# EAGLE design Upper Board (EAGLE 5.12)
PARTNO: 43045-0406
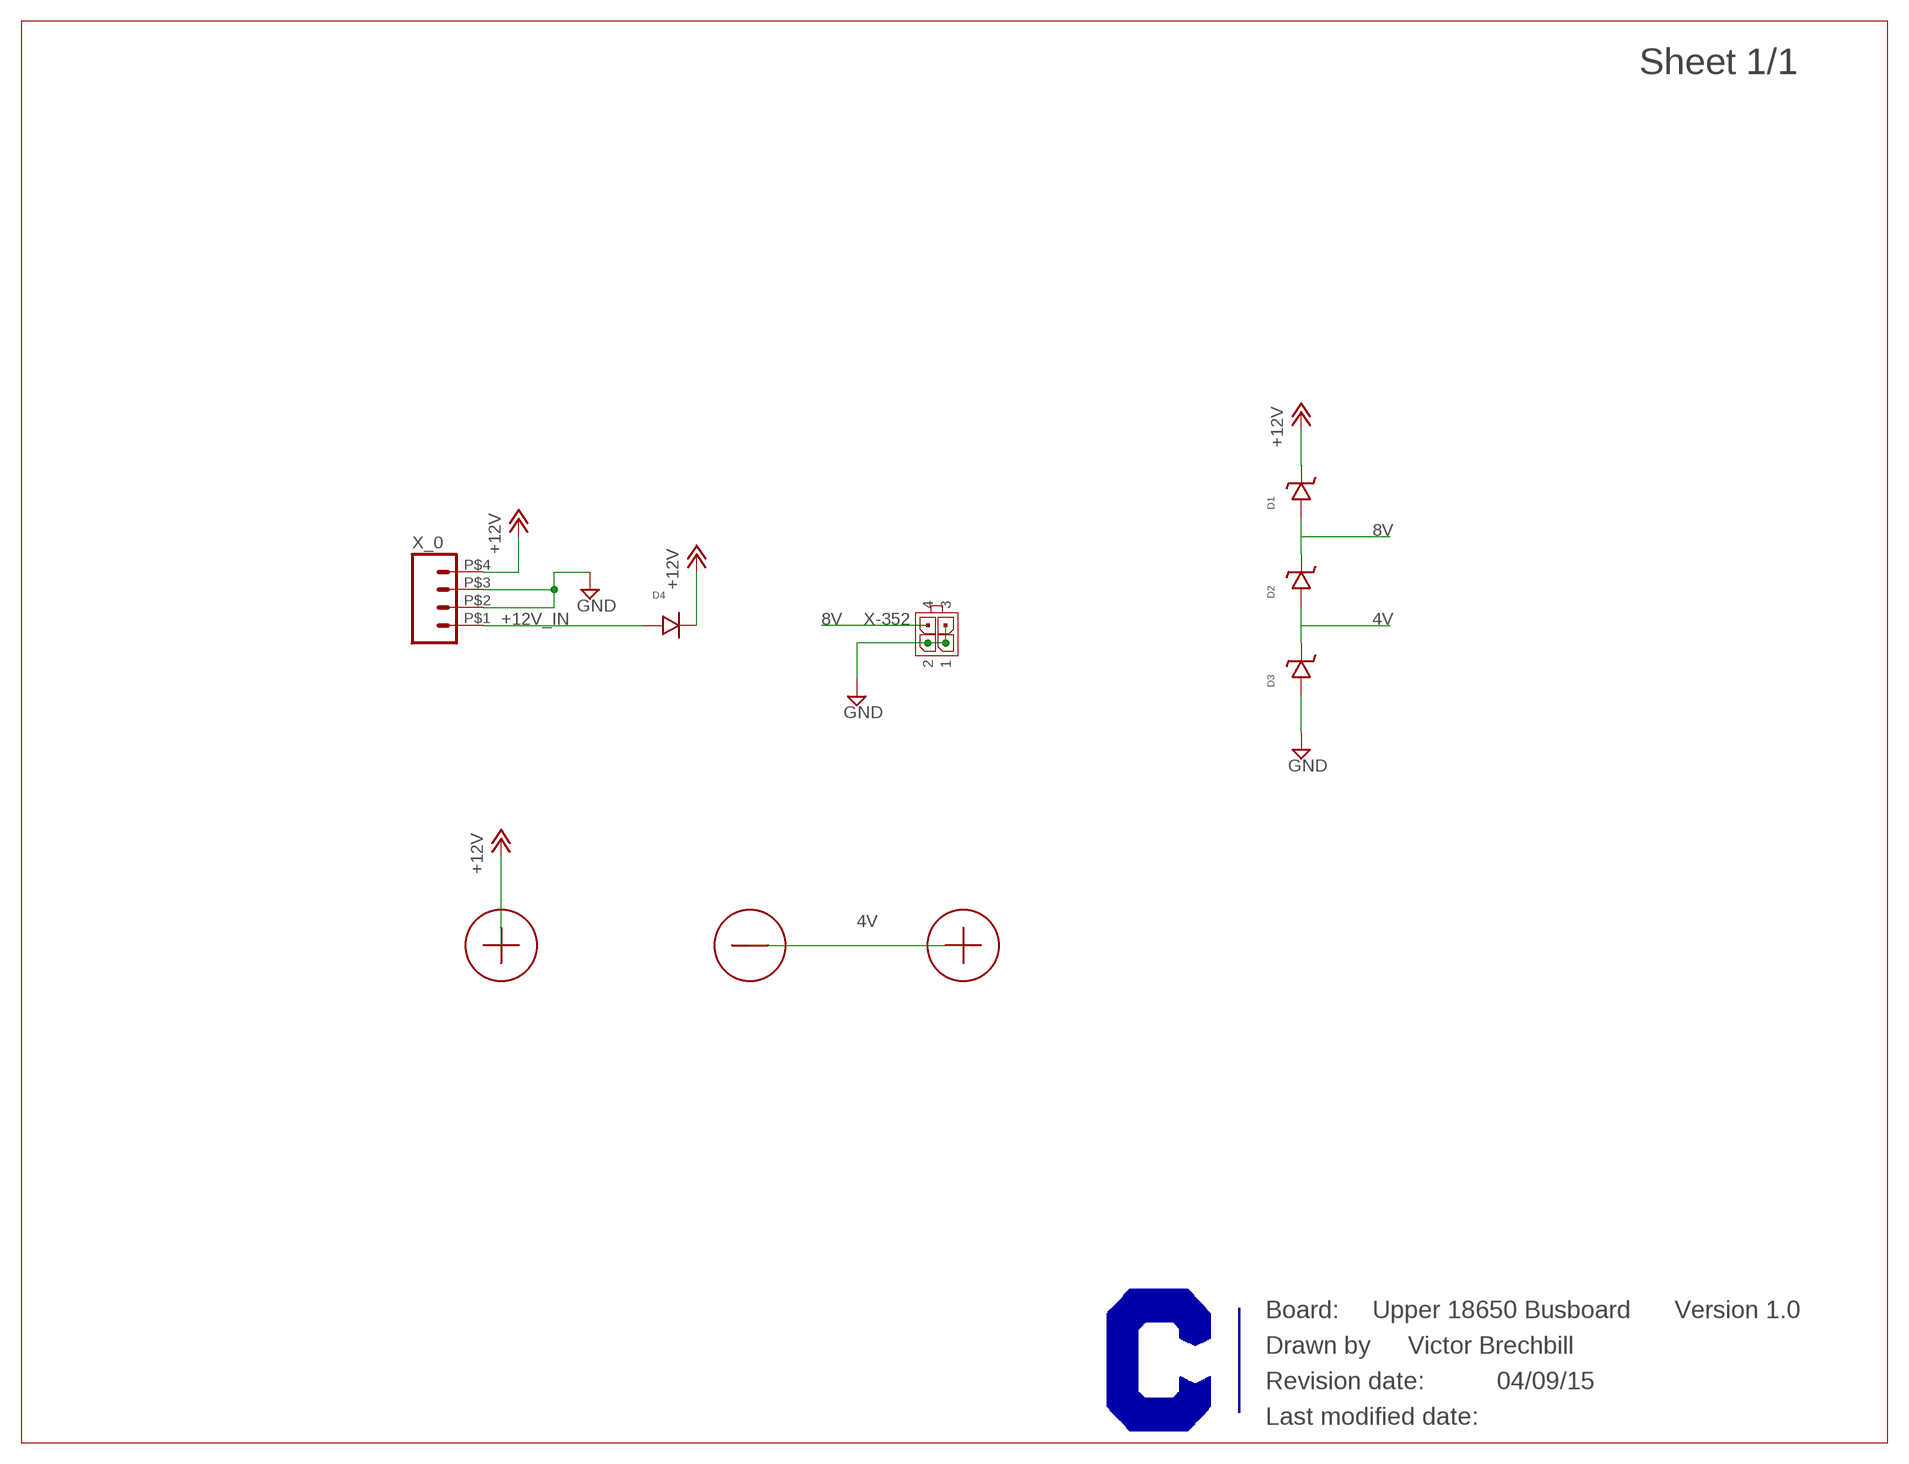
[diagram p0: schematic, sheet 1]

## Parts
D1  ZENER_DIODE-SOD-123  [SOD-123]
D2  ZENER_DIODE-SOD-123  [SOD-123]
D3  ZENER_DIODE-SOD-123  [SOD-123]
D4  RECT_DIODE  [DO-214AB]
U$1  CURRENT-C-LETTER-LANDSCAPE  [BLANK]
U$2  18650_PLUS  [BATTERY_CONTACT]
U$3  18650_PLUS  [BATTERY_CONTACT]
U$4  18650_MINUS  [BATTERY_CONTACT]
X-352  MICROFIT-04-DUAL-RA-SMD-CLIP_RETENTION  [MICROFIT-4-DUAL-RA-SMD-CLIP_RETENTION]
X_0  5MM_HEADER-4  [4POS-5MM]

## Nets
4V: D2.ANODE D3.CATHODE U$3.P$1 U$4.P$1
8V: D1.ANODE D2.CATHODE X-352.4
+12V: D1.CATHODE D4.C(CATHODE) U$2.P$1 X_0.P$4
+12V_IN: D4.A(ANODE) X_0.P$1
GND: D3.ANODE X-352.1 X-352.2 X-352.3 X_0.P$2 X_0.P$3

## Notes on the sheet
- Upper 18650 Busboard | Version 1.0
- Victor Brechbill
- 04/09/15

## Library data of the parts
D1-D3 = Diodes:ZENER_DIODE
D4 = Diodes:RECT_DIODE: Package DO-214AB http://www.digikey.com/product-detail/en/SK154-TP/SK154-TPCT-ND/1306217
U$1 = Frames:CURRENT-C-LETTER-LANDSCAPE; BOM: EXCLUDE
U$2 U$3 = Buckeye Current:18650_PLUS: http://www.digikey.com/product-detail/en/5223/5223K-ND/316374
U$4 = Buckeye Current:18650_MINUS: http://www.digikey.com/product-detail/en/5201/5201K-ND/316365
X-352 = Molex:MICROFIT-04-DUAL: Molex MicroFit 3.00mm Pitch Header, Surface Mount, Dual Row, 4 Circuits Molex P/N: 43045-0609 (vert) Drawing: http://www.molex.com/pdm_docs/sd/430450418_sd.pdf (vert) Information: http://www.molex.com/molex/products/datasheet.jsp?part=active/0430450418_PCB_HEADERS.xml (vert)
X_0 = Phoenix Contact:5MM_HEADER-4: 4 position, 5mm screw terminal header Pheonix Contact P/N: 1935187 Digikey 277-1579-ND <http://www.digikey.com/product-detail/en/1935187/277-1579-ND/568616>

## Board
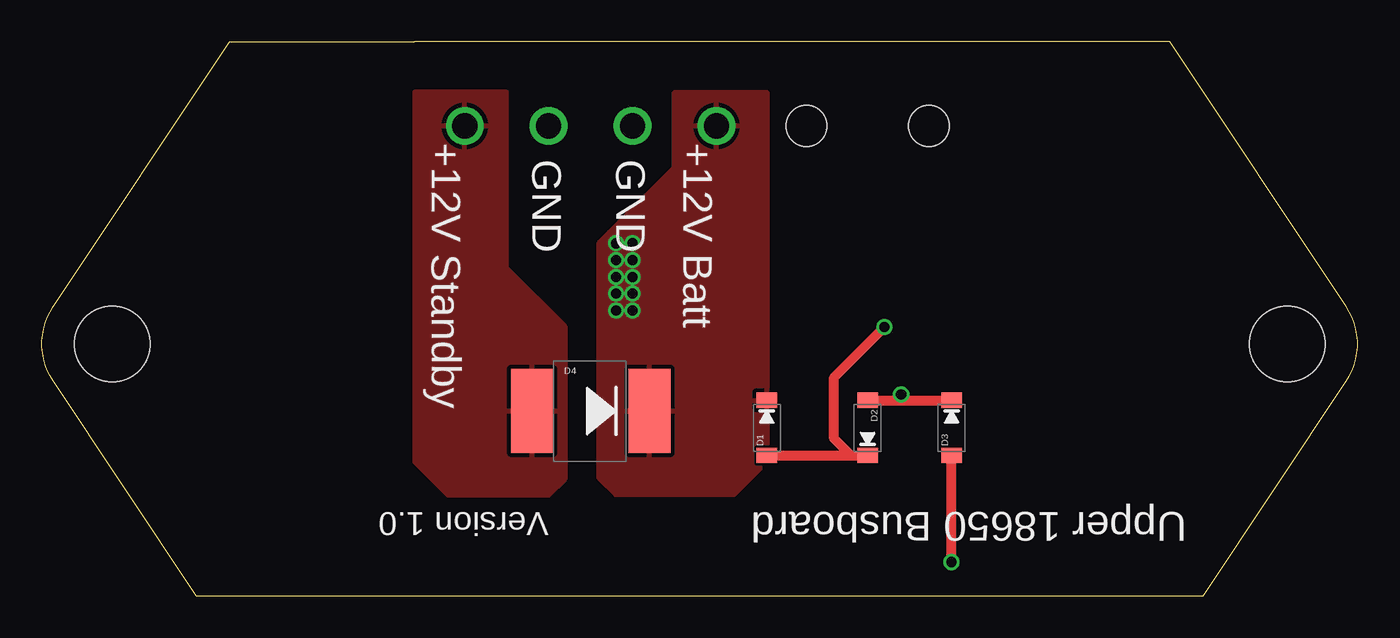
[diagram p1: board, top side]
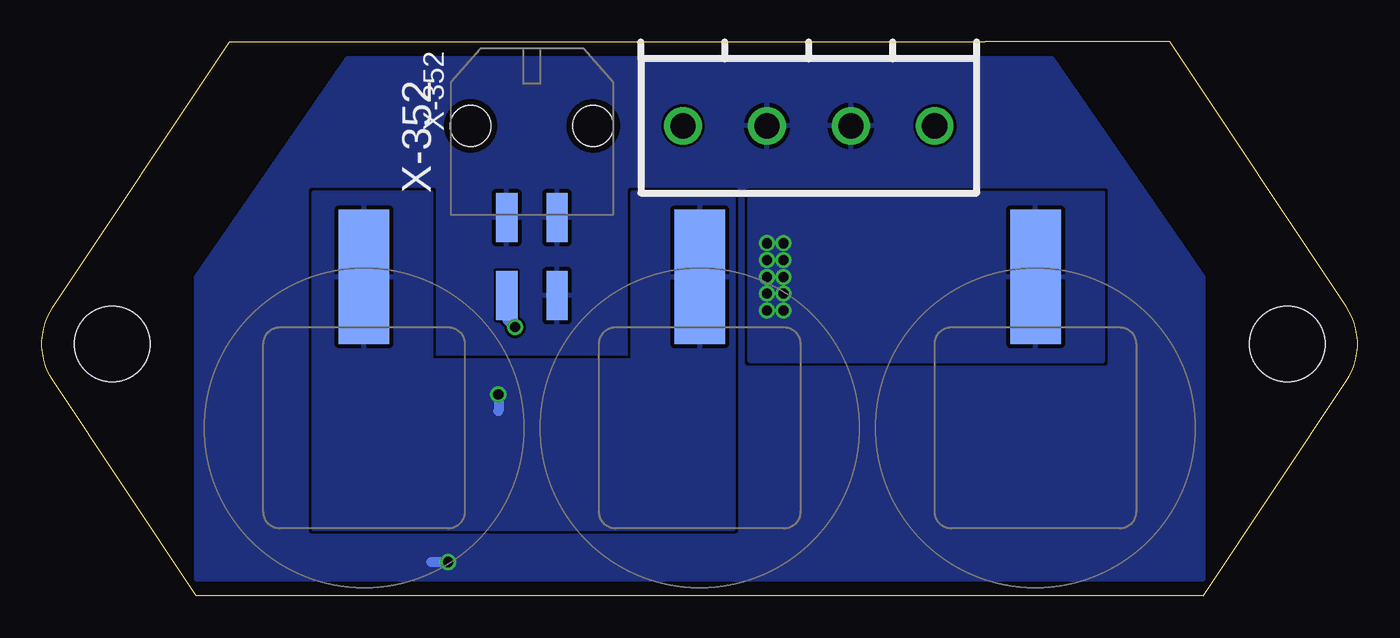
[diagram p2: board, bottom side, seen from below]

Size 78.38 x 33 mm. Coordinates in mm from the lower left corner, seen from the top.
Outline: 9.19,0 69.19,0 77.71,12.78 arc67 77.71,17.22 67.19,33 56.19,33 22.19,33 11.19,33 0.67,17.22 arc67 0.67,12.78 9.19,0
Copper layers (1*16): Top 0.0356mm / dielectric 1.5011mm / Bottom 0.0356mm
Design rules "OSH Park 2-layer": minimum track width 6mil, minimum drill 13mil, track to track 6mil, track to pad 6mil, pad to pad 6mil, via to via 6mil, smd to smd 6mil, copper to edge 15mil, drill to drill 6mil, minimum pad ring 7mil, minimum via ring 7mil, stop-mask expansion 4mil, vias tented up to drill 0mil, thermal gap 10mil
Holes 4.5 mm at 4.19,15 74.19,15

### Footprints (pad centres in the part's own frame; a part is rotated, then mirrored left to right if it is on the bottom)
SOD-123 = smd 0.91 x 1.22: ANODE -1.64,0; CATHODE 1.64,0
DO-214AB = smd 2.5 x 5: A 0,0; C 7,0
BATTERY_CONTACT = smd 3 x 8: P$1 0,-3
MICROFIT-4-DUAL-RA-SMD-CLIP_RETENTION = smd 1.27 x 2.921: 1 1.5,5.47; 2 -1.5,5.47; 3 -1.5,10.1; 4 1.5,10.1 | hole 2.413: 3.65,0; -3.65,0
4POS-5MM = drill 1.5 round: P$1 0,0; P$2 5,0; P$3 10,0; P$4 15,0

### Placement (x,y rotation side)
D1  43.19,10 90 top
D2  49.19,10 270 top
D3  54.19,10 90 top
D4  29.19,11 0 top
U$1  -41.61,39.37 0 top  (outside the outline)
U$2  19.19,16 180 bottom
U$3  59.19,16 180 bottom
U$4  39.19,16 180 bottom
X-352  49.19,28 180 bottom
X_0  25.19,28 180 bottom

### Tracks (layer width: path | path; a pad name or v marks a point on that pad's centre or on a via)
4V  (via drill 0.6)
  Top 0.61: D3.CATHODE D2.ANODE 50.83,11.64 v51.19,12
  Bottom 0.61: v51.19,12 51.19,11
  pour Bottom (isolate 0.305): 55.19,24 62.19,24 62.19,4 37.19,4 37.19,24 43.19,24 43.19,14 55.19,14
8V  (via drill 0.6)
  Top 0.61: D1.ANODE 48.19,8.36 | 48.19,8.36 D2.CATHODE | v50.19,16 47.19,13 47.19,9.36 48.19,8.36
  Bottom 0.61: X-352.4 50.69,16.5 v50.19,16
+12V  (via drill 0.6)
  other vias: 34.19,21 35.19,21 34.19,20 35.19,20 34.19,19 35.19,19 34.19,18 35.19,18 34.19,17 35.19,17
  pour Bottom (isolate 0.305): 15.19,24 15.19,14 36.19,14 36.19,24
  pour Top: 37.69,30 43.19,30 43.19,8 41.19,6 34.19,6 33.19,7 33.19,21 37.69,25.5
+12V_IN
  pour Top (isolate 0.305): 27.69,30 22.19,30 22.19,8 24.19,6 30.19,6 31.19,7 31.19,16 27.69,19.5
GND  (via drill 0.6)
  Top 0.61: v54.19,2 D3.ANODE
  Bottom 0.61: v54.19,2 55.19,2
  pour Bottom (rank 2): 9.19,1 9.19,19 18.19,32 60.19,32 69.19,19 69.19,1

### Text on the board
_tsilk: +12V Standby | +12V Batt | GND | GND | Version 1.0 | Upper 18650 Busboard
_bsilk: X-352